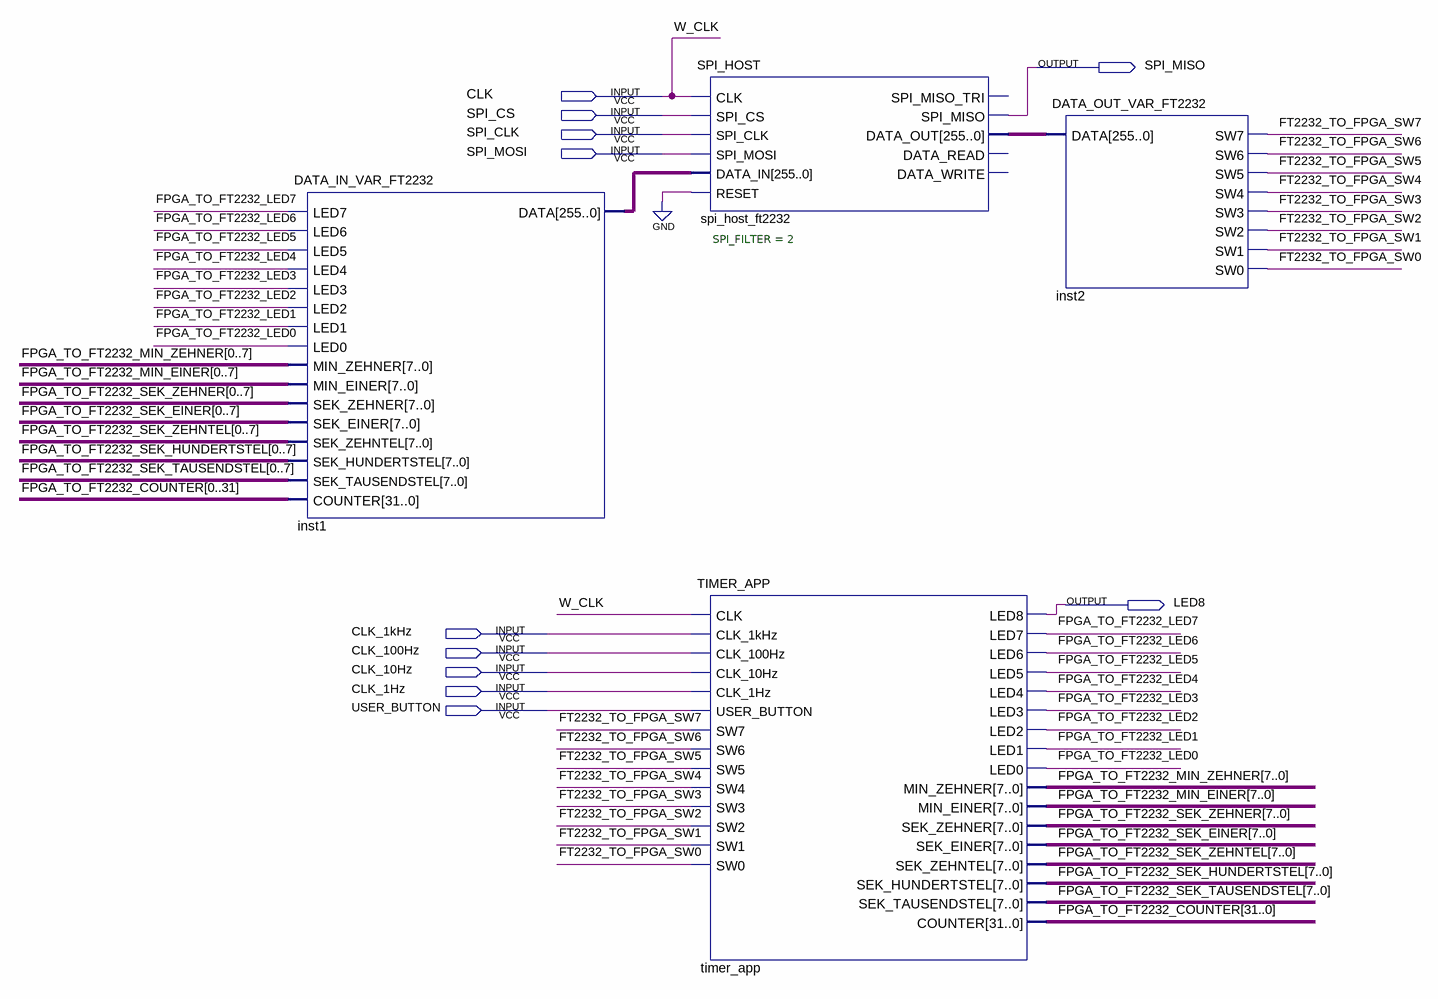
[diagram p0: schematic sheet]
// Quartus schematic APP_TIMER.bdf as structural Verilog: 4 symbols, 11 pins
module APP_TIMER (
  input  CLK,
  input  SPI_CS,
  input  SPI_CLK,
  input  SPI_MOSI,
  input  CLK_1kHz,
  input  CLK_100Hz,
  input  CLK_10Hz,
  input  CLK_1Hz,
  input  USER_BUTTON,
  output SPI_MISO,
  output LED8
);

  wire FPGA_TO_FT2232_LED0, FPGA_TO_FT2232_LED1, FPGA_TO_FT2232_LED2, FPGA_TO_FT2232_LED3,
       FPGA_TO_FT2232_LED4, FPGA_TO_FT2232_LED5, FPGA_TO_FT2232_LED6, FPGA_TO_FT2232_LED7,
       FT2232_TO_FPGA_SW0, FT2232_TO_FPGA_SW1, FT2232_TO_FPGA_SW2, FT2232_TO_FPGA_SW3, FT2232_TO_FPGA_SW4,
       FT2232_TO_FPGA_SW5, FT2232_TO_FPGA_SW6, FT2232_TO_FPGA_SW7;
  wire [7:0] FPGA_TO_FT2232_MIN_EINER, FPGA_TO_FT2232_MIN_ZEHNER, FPGA_TO_FT2232_SEK_EINER,
       FPGA_TO_FT2232_SEK_HUNDERTSTEL, FPGA_TO_FT2232_SEK_TAUSENDSTEL, FPGA_TO_FT2232_SEK_ZEHNER,
       FPGA_TO_FT2232_SEK_ZEHNTEL;
  wire [31:0] FPGA_TO_FT2232_COUNTER;
  wire [255:0] inst1_data, spi_host_ft2232_data_out;

  DATA_IN_VAR_FT2232 inst1 (
    .LED7(FPGA_TO_FT2232_LED7), .LED6(FPGA_TO_FT2232_LED6), .LED5(FPGA_TO_FT2232_LED5),
    .LED4(FPGA_TO_FT2232_LED4), .LED3(FPGA_TO_FT2232_LED3), .LED2(FPGA_TO_FT2232_LED2),
    .LED1(FPGA_TO_FT2232_LED1), .LED0(FPGA_TO_FT2232_LED0),
    .MIN_ZEHNER({FPGA_TO_FT2232_MIN_ZEHNER[0], FPGA_TO_FT2232_MIN_ZEHNER[1], FPGA_TO_FT2232_MIN_ZEHNER[2], FPGA_TO_FT2232_MIN_ZEHNER[3], FPGA_TO_FT2232_MIN_ZEHNER[4], FPGA_TO_FT2232_MIN_ZEHNER[5], FPGA_TO_FT2232_MIN_ZEHNER[6], FPGA_TO_FT2232_MIN_ZEHNER[7]}),
    .MIN_EINER({FPGA_TO_FT2232_MIN_EINER[0], FPGA_TO_FT2232_MIN_EINER[1], FPGA_TO_FT2232_MIN_EINER[2], FPGA_TO_FT2232_MIN_EINER[3], FPGA_TO_FT2232_MIN_EINER[4], FPGA_TO_FT2232_MIN_EINER[5], FPGA_TO_FT2232_MIN_EINER[6], FPGA_TO_FT2232_MIN_EINER[7]}),
    .SEK_ZEHNER({FPGA_TO_FT2232_SEK_ZEHNER[0], FPGA_TO_FT2232_SEK_ZEHNER[1], FPGA_TO_FT2232_SEK_ZEHNER[2], FPGA_TO_FT2232_SEK_ZEHNER[3], FPGA_TO_FT2232_SEK_ZEHNER[4], FPGA_TO_FT2232_SEK_ZEHNER[5], FPGA_TO_FT2232_SEK_ZEHNER[6], FPGA_TO_FT2232_SEK_ZEHNER[7]}),
    .SEK_EINER({FPGA_TO_FT2232_SEK_EINER[0], FPGA_TO_FT2232_SEK_EINER[1], FPGA_TO_FT2232_SEK_EINER[2], FPGA_TO_FT2232_SEK_EINER[3], FPGA_TO_FT2232_SEK_EINER[4], FPGA_TO_FT2232_SEK_EINER[5], FPGA_TO_FT2232_SEK_EINER[6], FPGA_TO_FT2232_SEK_EINER[7]}),
    .SEK_ZEHNTEL({FPGA_TO_FT2232_SEK_ZEHNTEL[0], FPGA_TO_FT2232_SEK_ZEHNTEL[1], FPGA_TO_FT2232_SEK_ZEHNTEL[2], FPGA_TO_FT2232_SEK_ZEHNTEL[3], FPGA_TO_FT2232_SEK_ZEHNTEL[4], FPGA_TO_FT2232_SEK_ZEHNTEL[5], FPGA_TO_FT2232_SEK_ZEHNTEL[6], FPGA_TO_FT2232_SEK_ZEHNTEL[7]}),
    .SEK_HUNDERTSTEL({FPGA_TO_FT2232_SEK_HUNDERTSTEL[0], FPGA_TO_FT2232_SEK_HUNDERTSTEL[1], FPGA_TO_FT2232_SEK_HUNDERTSTEL[2], FPGA_TO_FT2232_SEK_HUNDERTSTEL[3], FPGA_TO_FT2232_SEK_HUNDERTSTEL[4], FPGA_TO_FT2232_SEK_HUNDERTSTEL[5], FPGA_TO_FT2232_SEK_HUNDERTSTEL[6], FPGA_TO_FT2232_SEK_HUNDERTSTEL[7]}),
    .SEK_TAUSENDSTEL({FPGA_TO_FT2232_SEK_TAUSENDSTEL[0], FPGA_TO_FT2232_SEK_TAUSENDSTEL[1], FPGA_TO_FT2232_SEK_TAUSENDSTEL[2], FPGA_TO_FT2232_SEK_TAUSENDSTEL[3], FPGA_TO_FT2232_SEK_TAUSENDSTEL[4], FPGA_TO_FT2232_SEK_TAUSENDSTEL[5], FPGA_TO_FT2232_SEK_TAUSENDSTEL[6], FPGA_TO_FT2232_SEK_TAUSENDSTEL[7]}),
    .COUNTER({FPGA_TO_FT2232_COUNTER[0], FPGA_TO_FT2232_COUNTER[1], FPGA_TO_FT2232_COUNTER[2], FPGA_TO_FT2232_COUNTER[3], FPGA_TO_FT2232_COUNTER[4], FPGA_TO_FT2232_COUNTER[5], FPGA_TO_FT2232_COUNTER[6], FPGA_TO_FT2232_COUNTER[7], FPGA_TO_FT2232_COUNTER[8], FPGA_TO_FT2232_COUNTER[9], FPGA_TO_FT2232_COUNTER[10], FPGA_TO_FT2232_COUNTER[11], FPGA_TO_FT2232_COUNTER[12], FPGA_TO_FT2232_COUNTER[13], FPGA_TO_FT2232_COUNTER[14], FPGA_TO_FT2232_COUNTER[15], FPGA_TO_FT2232_COUNTER[16], FPGA_TO_FT2232_COUNTER[17], FPGA_TO_FT2232_COUNTER[18], FPGA_TO_FT2232_COUNTER[19], FPGA_TO_FT2232_COUNTER[20], FPGA_TO_FT2232_COUNTER[21], FPGA_TO_FT2232_COUNTER[22], FPGA_TO_FT2232_COUNTER[23], FPGA_TO_FT2232_COUNTER[24], FPGA_TO_FT2232_COUNTER[25], FPGA_TO_FT2232_COUNTER[26], FPGA_TO_FT2232_COUNTER[27], FPGA_TO_FT2232_COUNTER[28], FPGA_TO_FT2232_COUNTER[29], FPGA_TO_FT2232_COUNTER[30], FPGA_TO_FT2232_COUNTER[31]}),
    .DATA(inst1_data));
  SPI_HOST #(.SPI_FILTER(2)) spi_host_ft2232 (
    .CLK(CLK), .SPI_CS(SPI_CS), .SPI_CLK(SPI_CLK), .SPI_MOSI(SPI_MOSI), .DATA_IN(inst1_data), .RESET(1'b0),
    .SPI_MISO(SPI_MISO), .DATA_OUT(spi_host_ft2232_data_out));  // open: SPI_MISO_TRI, DATA_READ, DATA_WRITE
  TIMER_APP timer_app (
    .CLK(CLK), .CLK_1kHz(CLK_1kHz), .CLK_100Hz(CLK_100Hz), .CLK_10Hz(CLK_10Hz), .CLK_1Hz(CLK_1Hz),
    .USER_BUTTON(USER_BUTTON), .SW7(FT2232_TO_FPGA_SW7), .SW6(FT2232_TO_FPGA_SW6), .SW5(FT2232_TO_FPGA_SW5),
    .SW4(FT2232_TO_FPGA_SW4), .SW3(FT2232_TO_FPGA_SW3), .SW2(FT2232_TO_FPGA_SW2), .SW1(FT2232_TO_FPGA_SW1),
    .SW0(FT2232_TO_FPGA_SW0), .LED8(LED8), .LED7(FPGA_TO_FT2232_LED7), .LED6(FPGA_TO_FT2232_LED6),
    .LED5(FPGA_TO_FT2232_LED5), .LED4(FPGA_TO_FT2232_LED4), .LED3(FPGA_TO_FT2232_LED3),
    .LED2(FPGA_TO_FT2232_LED2), .LED1(FPGA_TO_FT2232_LED1), .LED0(FPGA_TO_FT2232_LED0),
    .MIN_ZEHNER(FPGA_TO_FT2232_MIN_ZEHNER), .MIN_EINER(FPGA_TO_FT2232_MIN_EINER),
    .SEK_ZEHNER(FPGA_TO_FT2232_SEK_ZEHNER), .SEK_EINER(FPGA_TO_FT2232_SEK_EINER),
    .SEK_ZEHNTEL(FPGA_TO_FT2232_SEK_ZEHNTEL), .SEK_HUNDERTSTEL(FPGA_TO_FT2232_SEK_HUNDERTSTEL),
    .SEK_TAUSENDSTEL(FPGA_TO_FT2232_SEK_TAUSENDSTEL), .COUNTER(FPGA_TO_FT2232_COUNTER));
  DATA_OUT_VAR_FT2232 inst2 (
    .DATA(spi_host_ft2232_data_out), .SW7(FT2232_TO_FPGA_SW7), .SW6(FT2232_TO_FPGA_SW6),
    .SW5(FT2232_TO_FPGA_SW5), .SW4(FT2232_TO_FPGA_SW4), .SW3(FT2232_TO_FPGA_SW3), .SW2(FT2232_TO_FPGA_SW2),
    .SW1(FT2232_TO_FPGA_SW1), .SW0(FT2232_TO_FPGA_SW0));

  // Other names for the same wires on the sheet: W_CLK = CLK
endmodule
